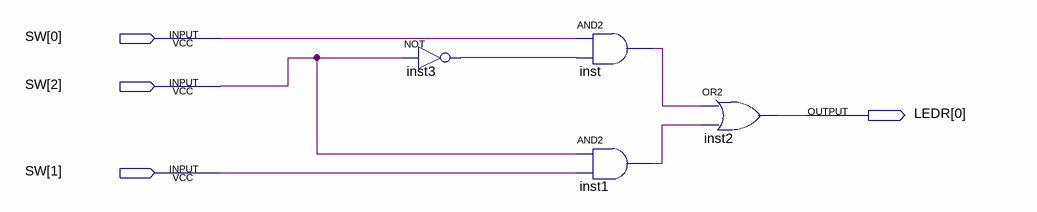
[diagram p0: schematic sheet]
// Quartus schematic part3_circuit1.bdf as structural Verilog: 4 symbols, 4 pins
module part3_circuit1 (
  input  [2:0] SW,
  output [0:0] LEDR
);

  wire inst1_out, inst3_out, inst_out;

  not inst3 (inst3_out, SW[2]);
  and inst (inst_out, SW[0], inst3_out);
  and inst1 (inst1_out, SW[2], SW[1]);
  or inst2 (LEDR[0], inst_out, inst1_out);
endmodule
